# EAGLE design SwitchBoard (EAGLE 6.5.0)
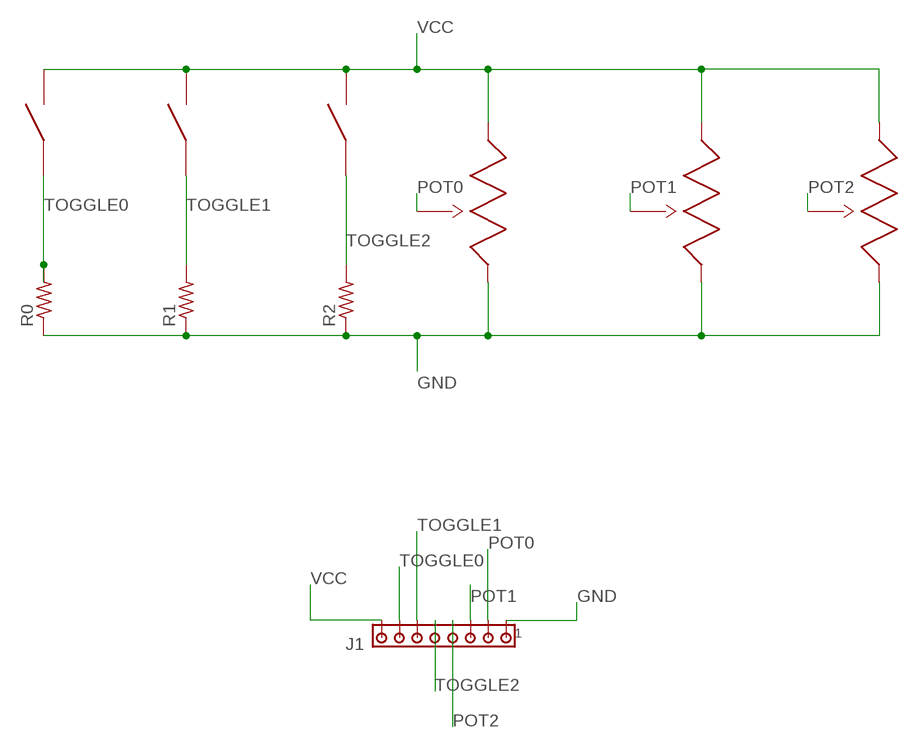
[diagram p0: schematic, sheet 1]

## Parts
J1  MTA08-100  [10X08MTA]
POT0  PRS11S-11  [POT-SMD]
POT1  PRS11S-11  [POT-SMD]
POT2  PRS11S-11  [POT-SMD]
R0  R-US_0204/5  [0204/5]
R1  R-US_0204/5  [0204/5]
R2  R-US_0204/5  [0204/5]
TOGGLE0  COM-09276  [SPST-TOGGLE-SWITCH]
TOGGLE1  COM-09276  [SPST-TOGGLE-SWITCH]
TOGGLE2  COM-09276  [SPST-TOGGLE-SWITCH]

## Nets
GND: J1.1 POT0.1 POT1.1 POT2.1 R0.1 R1.1 R2.1
POT0: J1.2 POT0.2
POT1: J1.3 POT1.2
POT2: J1.4 POT2.2
TOGGLE0: J1.7 R0.2 TOGGLE0.1
TOGGLE1: J1.6 R1.2 TOGGLE1.1
TOGGLE2: J1.5 R2.2 TOGGLE2.1
VCC: J1.8 POT0.3 POT1.3 POT2.3 TOGGLE0.2 TOGGLE1.2 TOGGLE2.2

## Library data of the parts
J1 = con-amp:MTA08-100: AMP connector
POT0 POT1 POT2 = PhysicalSwitches:PRS11S-11: SMD Potentiometer Digi-Key: PRS11S-N20F-503B1-ND
R0 R1 R2 = rcl:R-US_: RESISTOR, American symbol
TOGGLE0 TOGGLE1 TOGGLE2 = PhysicalSwitches:COM-09276: SPST Single Pole Single Throw Toggle Switch SparkFun: COM-09276

## Board
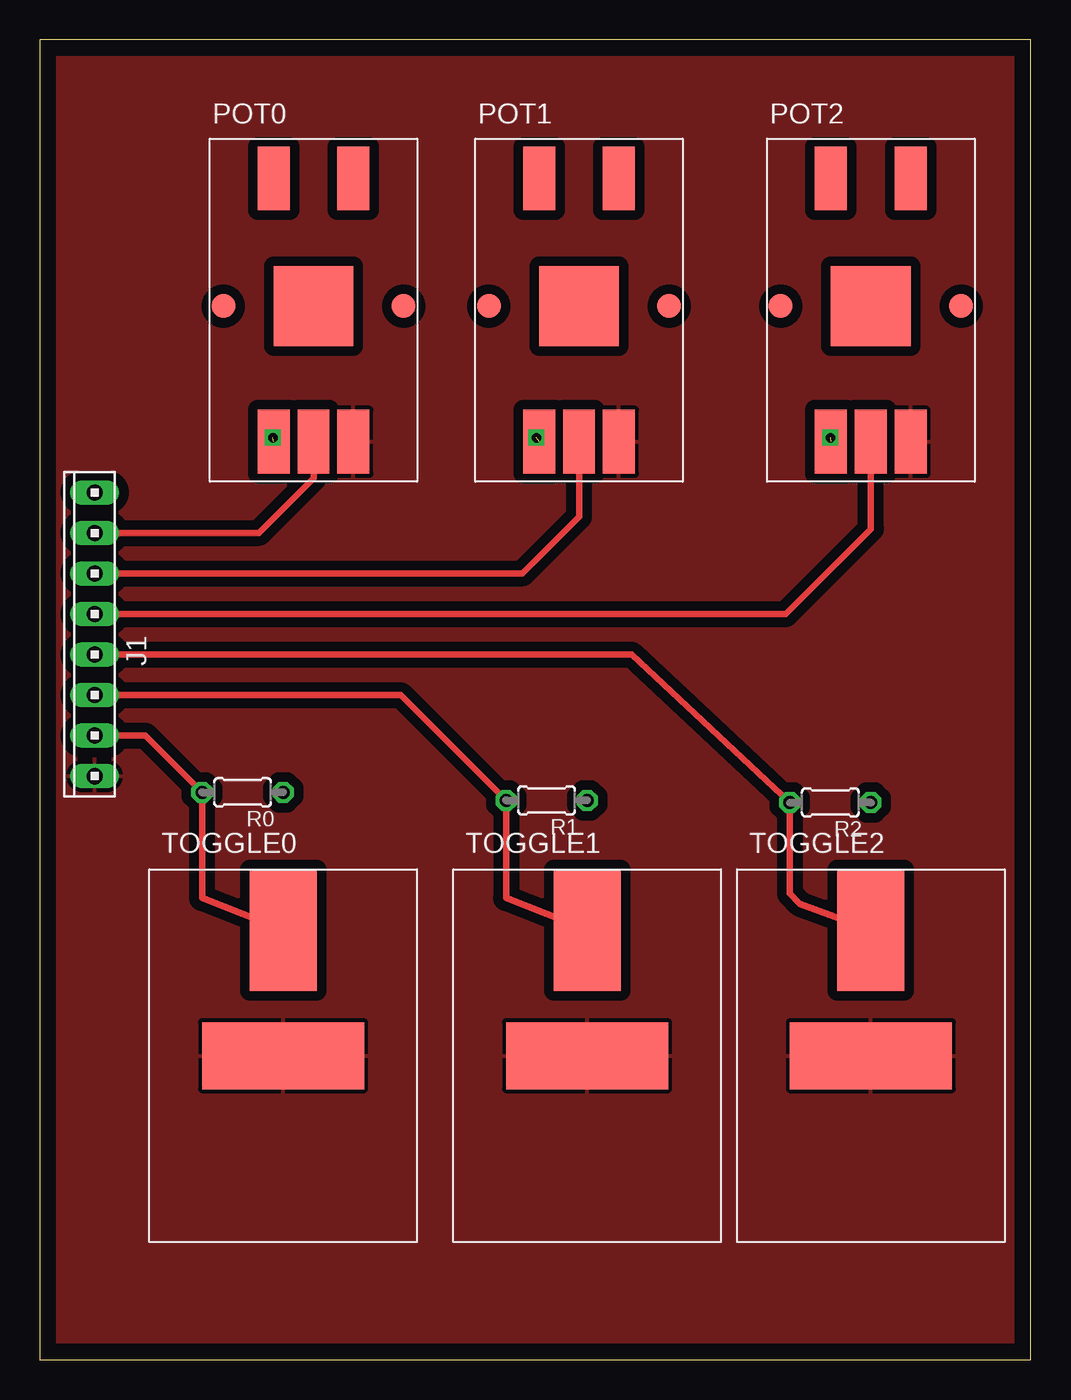
[diagram p1: board, top side]
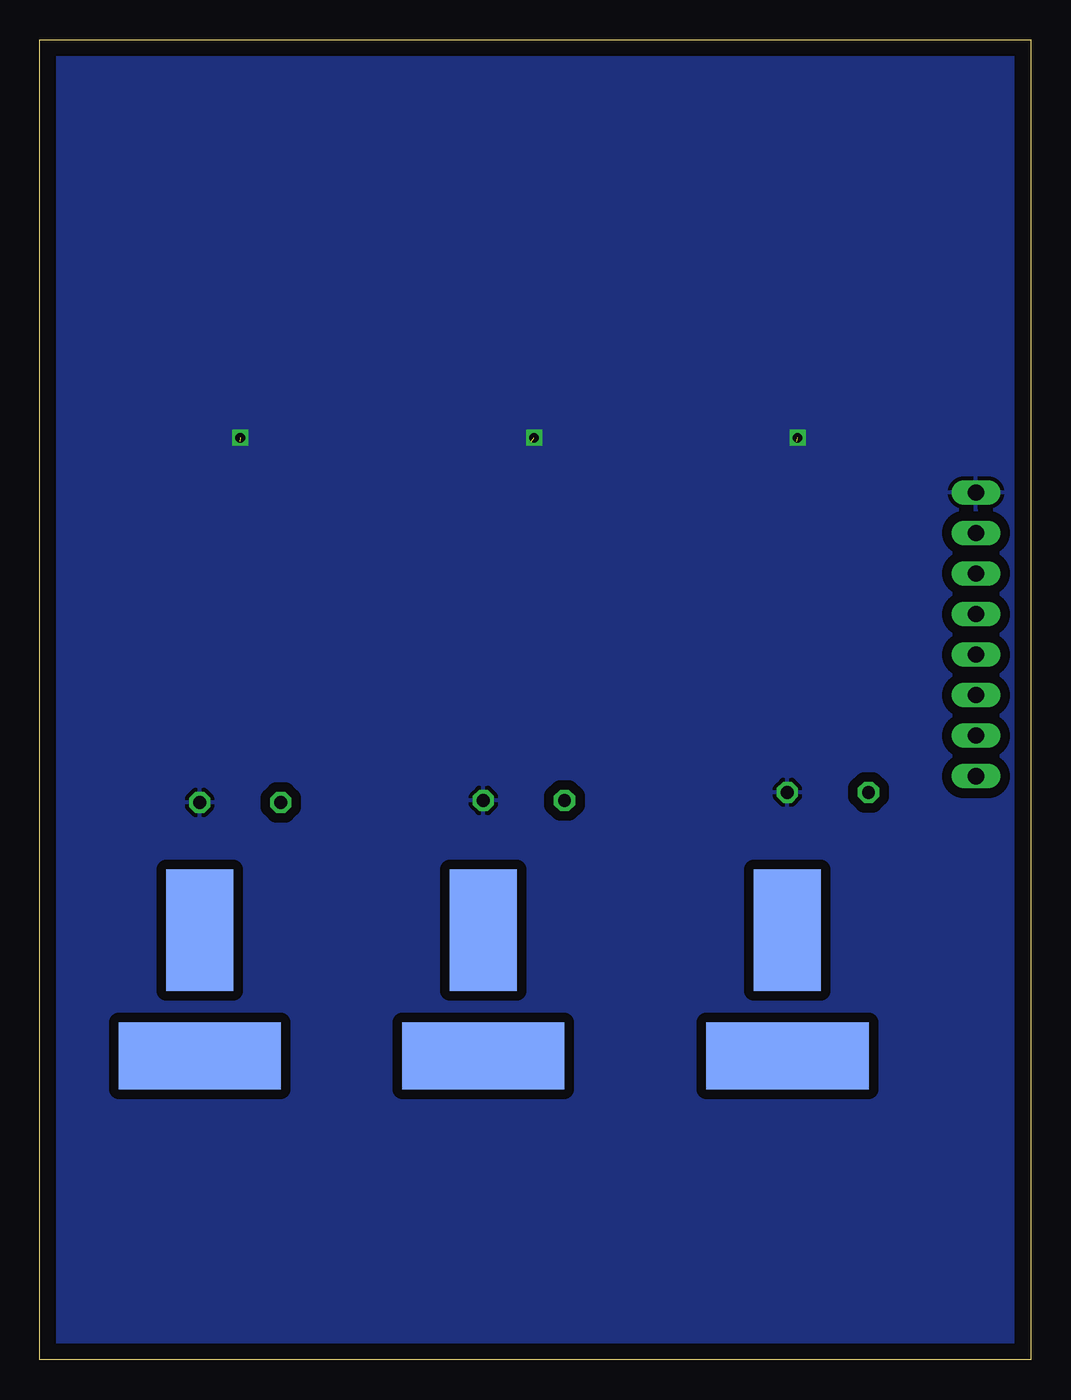
[diagram p2: board, bottom side, seen from below]

Size 62.08 x 82.73 mm. Coordinates in mm from the lower left corner, seen from the top.
Outline: 0,0 62.08,0 62.08,82.73 0,82.73 0,0
Copper layers (1*16): Top 0.035mm / dielectric 1.5mm / Bottom 0.035mm
Design rules "default": minimum track width 10mil, minimum drill 24mil, track to track 8mil, track to pad 8mil, pad to pad 8mil, via to via 8mil, smd to smd 8mil, copper to edge 40mil, drill to drill 8mil, minimum pad ring 10mil, minimum via ring 8mil, stop-mask expansion 4mil, vias tented up to drill 0mil, thermal gap 10mil

### Footprints (pad centres in the part's own frame; a part is rotated, then mirrored left to right if it is on the bottom)
10X08MTA = drill 1.016 long: 1 8.89,0; 2 6.35,0; 3 3.81,0; 4 1.27,0; 5 -1.27,0; 6 -3.81,0; 7 -6.35,0; 8 -8.89,0
POT-SMD = smd 2 x 4: 1 -2.5,-8.5; 2 0,-8.5; 3 2.5,-8.5; NOCONN1 -2.5,8; NOCONN2 2.5,8 | smd 1.5 x 1.5: DRILL1 -5.65,0; DRILL2 5.65,0 | smd 5 x 5: GLUEPAD 0,0
0204/5 = drill 0.813 octagon: 1 -2.54,0; 2 2.54,0
SPST-TOGGLE-SWITCH = smd 4.191 x 7.62: 1 0,7.874 | smd 10.16 x 4.191: 2 0,0 | smd 4.191 x 7.62 bottom: 3 0,7.874 | smd 10.16 x 4.191 bottom: 4 0,0

### Placement (x,y rotation side)
J1  3.43,45.47 90 top
POT0  17.14,66.04 0 top
POT1  33.78,66.04 0 top
POT2  52.07,66.04 0 top
R0  12.7,35.56 180 top
R1  31.75,35.05 180 top
R2  49.53,34.92 180 top
TOGGLE0  15.24,19.05 0 top
TOGGLE1  34.29,19.05 0 top
TOGGLE2  52.07,19.05 0 top

### Tracks (layer width: path | path; a pad name or v marks a point on that pad's centre or on a via)
GND  (via drill 0.6)  (3 unrouted)
  other vias: 14.61,57.78 31.11,57.78 49.53,57.78
  pour Bottom (isolate 0.61): 0,0 0,82.8 62.1,82.8 62.1,0
POT0
  Top 0.406: J1.2 13.72,51.82 17.14,55.24 POT0.2
POT1
  Top 0.406: J1.3 30.23,49.28 33.78,52.83 POT1.2
POT2
  Top 0.406: J1.4 46.74,46.74 52.07,52.07 POT2.2
TOGGLE0
  Top 0.406: J1.7 6.6,39.12 R0.2 10.16,28.93 TOGGLE0.1
TOGGLE1
  Top 0.406: J1.6 22.61,41.66 R1.2 29.21,28.93 TOGGLE1.1
TOGGLE2
  Top 0.406: J1.5 37.08,44.2 R2.2 46.99,29.21 47.62,28.57 TOGGLE2.1
VCC
  pour Top (isolate 0.61): 0,0 0,82.8 62.1,82.8 62.1,0